# Altium schematic sheet Sheet1.SchDoc
size A
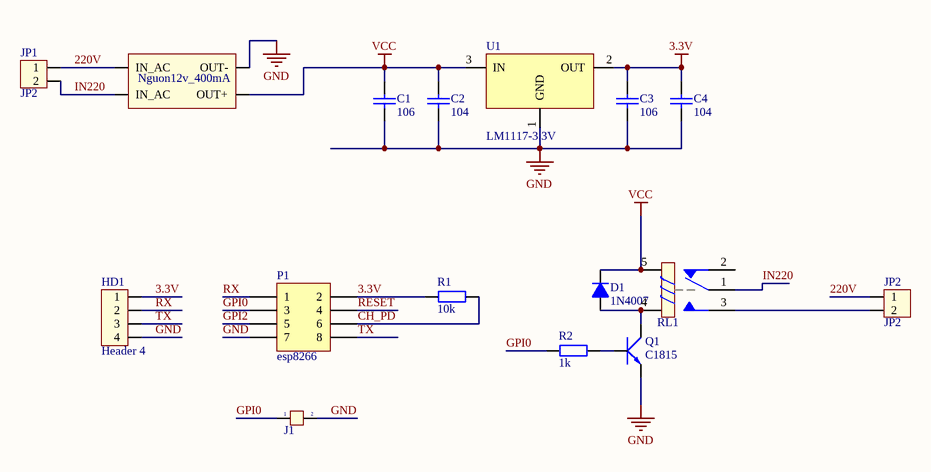
[diagram p0: Sheet1.SchDoc]

## Parts
C1  106  [0805_MH]
C2  104  [0805_MH]
C3  106  [0805_MH]
C4  104  [0805_MH]
D1  1N4007  [Diode zenner]
HD1  Header 4  [Jumper 4]
J1  Jumper 2  [JP2]  (value not drawn)
JP1  JP2  [CON 2]
JP2  JP2  [CON 2]
NguonKhongVo_1  NguonKhongVo_12v_400ma  [NguonKhongVo_12V_400mA]  (value not drawn)
P1  esp8266  [HDR2X4]
Q1  C1815  [TRAN-LOWPOWER]
R1  10k  [0805_MH]
R2  1k  [0805_MH]
RL1  Relay ?V - 10A  [RELAY5PIN-10A]  (value not drawn)
U1  LM1117-3.3V  [LM1117-SOP]

## Nets
3.3V: C3.2 C4.2 HD1.1 P1.2 R1.1 U1.2(OUT)
GND: C1.1 C2.1 C3.1 C4.1 HD1.4 J1.2 NguonKhongVo_1.4(OUT-) P1.7 Q1.1(E) U1.1(GND)
VCC: C1.2 C2.2 D1.2(K) NguonKhongVo_1.3(OUT+) RL1.5 U1.3(IN)
220V: JP1.1 JP2.1 NguonKhongVo_1.1(IN_AC)
CH_PD: P1.6 R1.2
GPI0: J1.1 P1.3 R2.1
GPI2: P1.5
IN220: JP1.2 NguonKhongVo_1.2(IN_AC) RL1.1
RESET: P1.4
RX: HD1.2 P1.1
TX: HD1.3 P1.8
NetD1_1: D1.1(A) Q1.2(C) RL1.4
NetJP2_2: JP2.2 RL1.3
NetQ1_3: Q1.3(B) R2.2

Not connected (* = marked no-connect by the designer): RL1 2

## Notes on the sheet
- (in symbol NguonKhongVo_12v_400ma) Nguon12v_400mA

## Library data of the parts
C1-C4 = CAP 0805
D1 = D1A: Diode 1A; Value: 1N4007
HD1 = Hed4: Header 4 (Green); Value: Header 4
J1 = JP 2: Value: JP 2
JP1 JP2 = JUMP 2: JUMP DON DUC 2.54; Value: Connector 2
NguonKhongVo_1 = NguonKhongVo_12v_400ma: Value: Header 4
P1 = Header 4X2: Header, 4-Pin, Dual row; LatestRevisionDate: 17-Jul-2002; LatestRevisionNote: Re-released for DXP Platform.; Publisher: Altium Limited
Q1 = C1815: NPN 600mW, ECB; Value: C1815
R1 R2 = R1/4W: Resistor 1/4W; Value: R1/4W - 1K
RL1 = Relay 10A: Relay SPDT,10A - 12VDC 5 Pin
U1 = LM1117: 800mA Low-Dropout Linear Regulator; Creator: Nguyen Ba Bien; Website: http://group3i.net